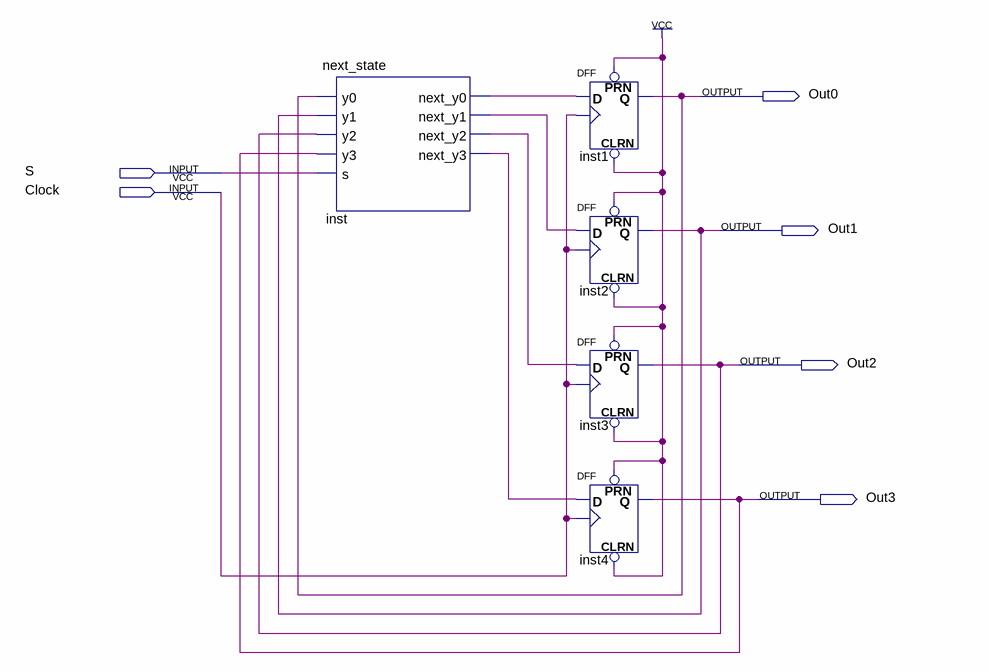
[diagram p0: schematic sheet]
// Quartus schematic state_machine.bdf as structural Verilog: 5 symbols, 6 pins
module state_machine (
  input  S,
  input  Clock,
  output Out0,
  output Out1,
  output Out2,
  output Out3
);

  wire inst_next_y0, inst_next_y1, inst_next_y2, inst_next_y3;

  next_state inst (
    .y0(Out0), .y1(Out1), .y2(Out2), .y3(Out3), .s(S), .next_y0(inst_next_y0), .next_y1(inst_next_y1),
    .next_y2(inst_next_y2), .next_y3(inst_next_y3));
  DFF inst1 (.CLRN(1'b1), .CLK(Clock), .D(inst_next_y0), .PRN(1'b1), .Q(Out0));
  DFF inst2 (.CLRN(1'b1), .CLK(Clock), .D(inst_next_y1), .PRN(1'b1), .Q(Out1));
  DFF inst3 (.CLRN(1'b1), .CLK(Clock), .D(inst_next_y2), .PRN(1'b1), .Q(Out2));
  DFF inst4 (.CLRN(1'b1), .CLK(Clock), .D(inst_next_y3), .PRN(1'b1), .Q(Out3));
endmodule
